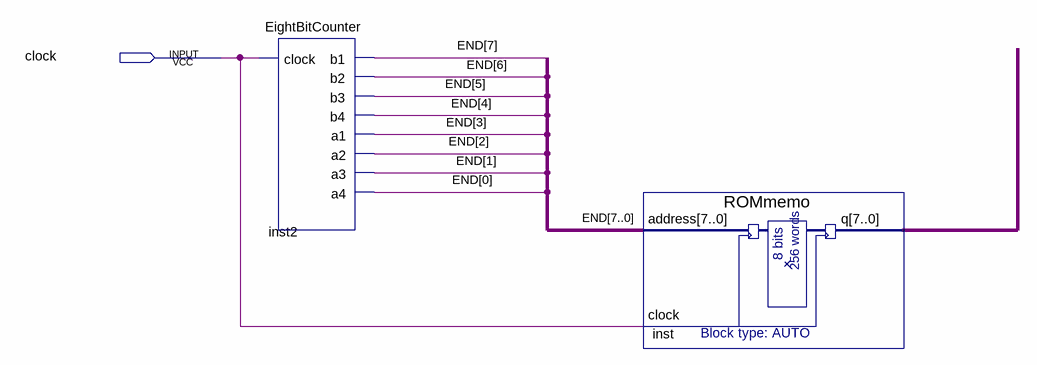
[diagram p0: schematic sheet]
// Quartus schematic microprocessadorProjetoFinal.bdf as structural Verilog: 2 symbols, 1 pins
module microprocessadorProjetoFinal (
  input  clock
);

  wire [7:0] END, inst_q;

  EightBitCounter inst2 (
    .clock(clock), .b1(END[7]), .b2(END[6]), .b3(END[5]), .b4(END[4]), .a1(END[3]), .a2(END[2]), .a3(END[1]),
    .a4(END[0]));
  ROMmemo inst (.address(END), .clock(clock), .q(inst_q));
endmodule
